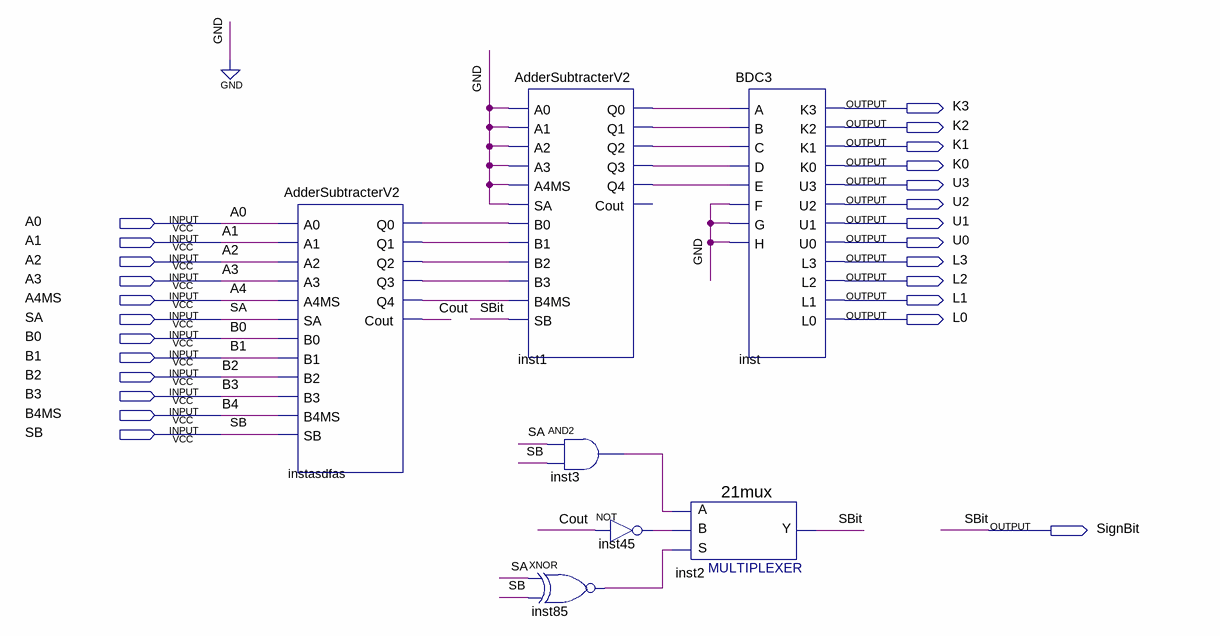
[diagram p0: schematic sheet]
// Quartus schematic AdderCalcV2.bdf as structural Verilog: 7 symbols, 25 pins
module AdderCalcV2 (
  input  A0,
  input  A1,
  input  A2,
  input  A3,
  input  A4MS,
  input  SA,
  input  B0,
  input  B1,
  input  B2,
  input  B3,
  input  B4MS,
  input  SB,
  output K3,
  output K2,
  output K1,
  output K0,
  output U3,
  output U2,
  output U1,
  output U0,
  output L3,
  output L2,
  output L1,
  output L0,
  output SignBit
);

  wire Cout, inst1_q0, inst1_q1, inst1_q2, inst1_q3, inst1_q4, inst3_out, inst45_out, inst85_out,
       instasdfas_q0, instasdfas_q1, instasdfas_q2, instasdfas_q3, instasdfas_q4;

  AdderSubtracterV2 instasdfas (
    .A0(A0), .A1(A1), .A2(A2), .A3(A3), .A4MS(A4MS), .SA(SA), .B0(B0), .B1(B1), .B2(B2), .B3(B3),
    .B4MS(B4MS), .SB(SB), .Q0(instasdfas_q0), .Q1(instasdfas_q1), .Q2(instasdfas_q2), .Q3(instasdfas_q3),
    .Q4(instasdfas_q4), .Cout(Cout));
  AdderSubtracterV2 inst1 (
    .A0(1'b0), .A1(1'b0), .A2(1'b0), .A3(1'b0), .A4MS(1'b0), .SA(1'b0), .B0(instasdfas_q0),
    .B1(instasdfas_q1), .B2(instasdfas_q2), .B3(instasdfas_q3), .B4MS(instasdfas_q4), .SB(SignBit),
    .Q0(inst1_q0), .Q1(inst1_q1), .Q2(inst1_q2), .Q3(inst1_q3), .Q4(inst1_q4));  // open: Cout
  and inst3 (inst3_out, SA, SB);
  xnor inst85 (inst85_out, SA, SB);
  not inst45 (inst45_out, Cout);
  \21mux  inst2 (.S(inst85_out), .B(inst45_out), .A(inst3_out), .Y(SignBit));
  BDC3 inst (
    .A(inst1_q0), .B(inst1_q1), .C(inst1_q2), .D(inst1_q3), .E(inst1_q4), .F(1'b0), .G(1'b0), .H(1'b0),
    .K3(K3), .K2(K2), .K1(K1), .K0(K0), .U3(U3), .U2(U2), .U1(U1), .U0(U0), .L3(L3), .L2(L2), .L1(L1), .L0(L0));

  // Other names for the same wires on the sheet: A4 = A4MS; B4 = B4MS; SBit = SignBit
endmodule
